# Altium schematic sheet ZMBo Main.SchDoc
size B
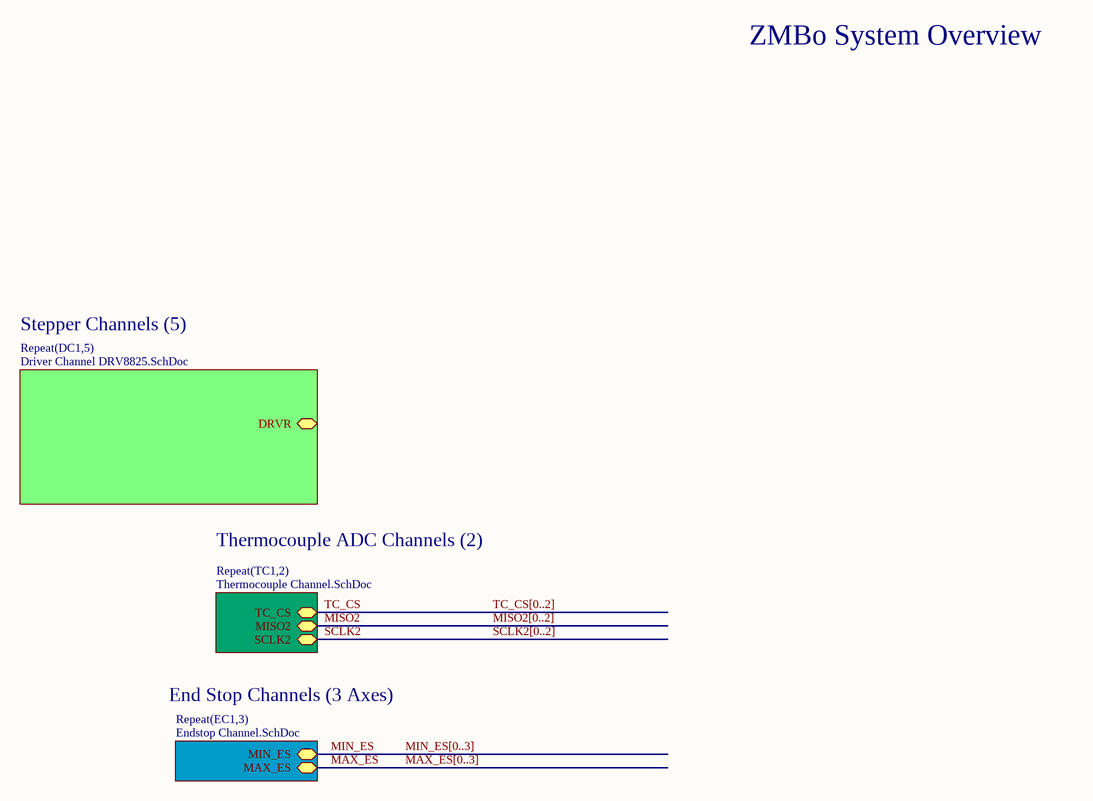
[diagram p0: ZMBo Main.SchDoc]

## Sub-sheets
Repeat(DC1,5) = Driver Channel DRV8825.SchDoc: DRVR (harness STEP_BUS)
Repeat(EC1,3) = Endstop Channel.SchDoc: MAX_ES, MIN_ES
Repeat(TC1,2) = Thermocouple Channel.SchDoc: SCLK2, MISO2, TC_CS

## Nets
MAX_ES: sheet Repeat(EC1,3)/MAX_ES
MIN_ES: sheet Repeat(EC1,3)/MIN_ES
MISO2: sheet Repeat(TC1,2)/MISO2
SCLK2: sheet Repeat(TC1,2)/SCLK2
TC_CS: sheet Repeat(TC1,2)/TC_CS

## Buses and harness runs
bus MAX_ES[0..3]
bus MIN_ES[0..3]
bus MISO2[0..2]
bus SCLK2[0..2]
bus TC_CS[0..2]

## Notes on the sheet
- ZMBo System Overview
- Stepper Channels (5)
- Thermocouple ADC Channels (2)
- End Stop Channels (3 Axes)